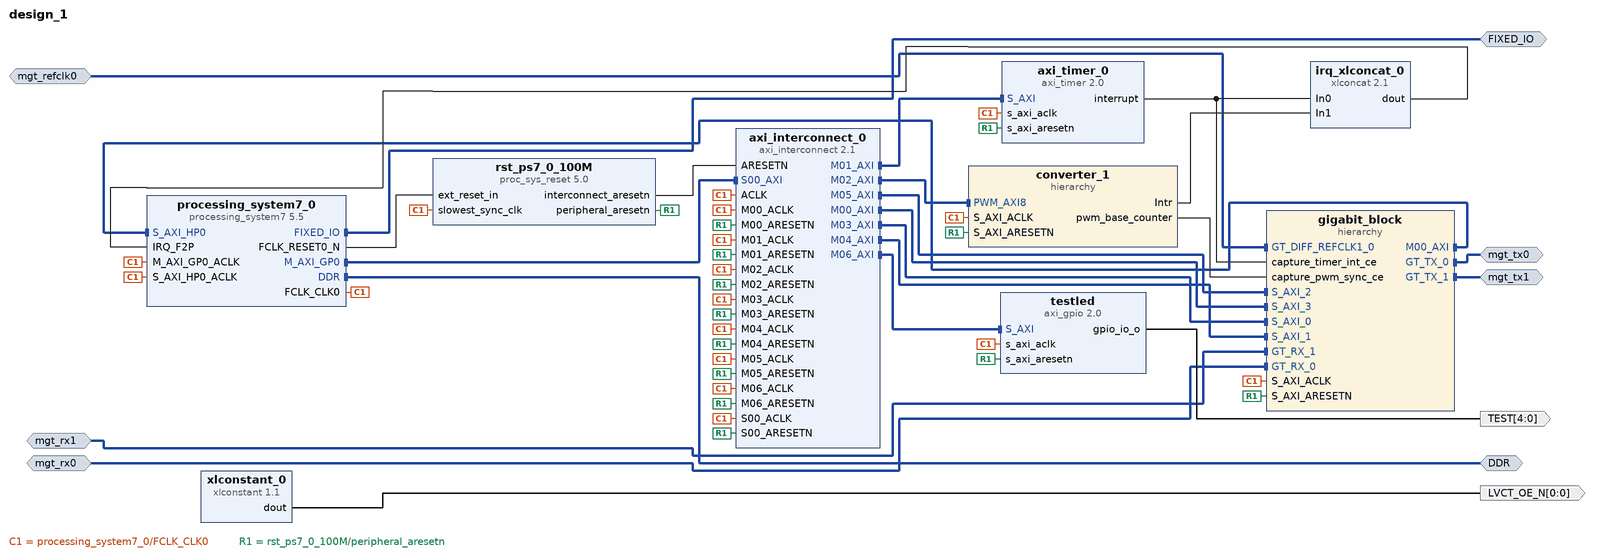
[diagram p0: block diagram of the top level]
# Vivado block design design_1, xc7z030sbg485-1, Vivado 2019.1
create_bd_design design_1

create_bd_intf_port -mode Master -vlnv xilinx.com:interface:ddrx_rtl:1.0 DDR
create_bd_intf_port -mode Master -vlnv xilinx.com:display_processing_system7:fixedio_rtl:1.0 FIXED_IO
create_bd_intf_port -mode Master -vlnv xilinx.com:display_aurora:GT_Serial_Transceiver_Pins_TX_rtl:1.0 mgt_tx0
create_bd_intf_port -mode Master -vlnv xilinx.com:display_aurora:GT_Serial_Transceiver_Pins_TX_rtl:1.0 mgt_tx1
create_bd_intf_port -mode Slave -vlnv xilinx.com:display_aurora:GT_Serial_Transceiver_Pins_RX_rtl:1.0 mgt_rx0
create_bd_intf_port -mode Slave -vlnv xilinx.com:display_aurora:GT_Serial_Transceiver_Pins_RX_rtl:1.0 mgt_rx1
create_bd_intf_port -mode Slave -vlnv xilinx.com:interface:diff_clock_rtl:1.0 mgt_refclk0
set_property -dict {CONFIG.FREQ_HZ 125000000} [get_bd_intf_ports mgt_refclk0]
create_bd_port -dir O -from 0 -to 0 LVCT_OE_N
create_bd_port -dir O -from 4 -to 0 -type data TEST

create_bd_cell -type hier converter_1
create_bd_cell -type ip -vlnv xilinx.com:ip:axi_interconnect:2.1 axi_interconnect_0
set_property -dict {CONFIG.NUM_MI 7 CONFIG.SYNCHRONIZATION_STAGES 2} [get_bd_cells axi_interconnect_0]
create_bd_cell -type ip -vlnv xilinx.com:ip:axi_timer:2.0 axi_timer_0
create_bd_cell -type ip -vlnv xilinx.com:ip:xlconcat:2.1 irq_xlconcat_0
set_property -dict {CONFIG.NUM_PORTS 2} [get_bd_cells irq_xlconcat_0]
create_bd_cell -type ip -vlnv xilinx.com:ip:processing_system7:5.5 processing_system7_0
set_property -dict [list \
  CONFIG.PCW_APU_PERIPHERAL_FREQMHZ 667 \
  CONFIG.PCW_CAN1_CAN1_IO {MIO 48 .. 49} \
  CONFIG.PCW_CAN1_PERIPHERAL_ENABLE 1 \
  CONFIG.PCW_ENET0_ENET0_IO {MIO 16 .. 27} \
  CONFIG.PCW_ENET0_GRP_MDIO_ENABLE 1 \
  CONFIG.PCW_ENET0_GRP_MDIO_IO {MIO 52 .. 53} \
  CONFIG.PCW_ENET0_PERIPHERAL_ENABLE 1 \
  CONFIG.PCW_ENET0_RESET_ENABLE 0 \
  CONFIG.PCW_ENET_RESET_ENABLE 1 \
  CONFIG.PCW_ENET_RESET_SELECT {Share reset pin} \
  CONFIG.PCW_EN_CLK1_PORT 1 \
  CONFIG.PCW_FCLK_CLK1_BUF TRUE \
  CONFIG.PCW_FPGA0_PERIPHERAL_FREQMHZ 100 \
  CONFIG.PCW_FPGA1_PERIPHERAL_FREQMHZ 200 \
  CONFIG.PCW_FPGA2_PERIPHERAL_FREQMHZ 33.333333 \
  CONFIG.PCW_FPGA_FCLK1_ENABLE 1 \
  CONFIG.PCW_GPIO_MIO_GPIO_ENABLE 1 \
  CONFIG.PCW_GPIO_MIO_GPIO_IO MIO \
  CONFIG.PCW_GPIO_PERIPHERAL_ENABLE 1 \
  CONFIG.PCW_I2C_RESET_ENABLE 0 \
  CONFIG.PCW_IRQ_F2P_INTR 1 \
  CONFIG.PCW_PERIPHERAL_BOARD_PRESET part0 \
  CONFIG.PCW_PRESET_BANK1_VOLTAGE {LVCMOS 1.8V} \
  CONFIG.PCW_QSPI_GRP_FBCLK_ENABLE 1 \
  CONFIG.PCW_QSPI_GRP_FBCLK_IO {MIO 8} \
  CONFIG.PCW_QSPI_GRP_SINGLE_SS_ENABLE 1 \
  CONFIG.PCW_QSPI_GRP_SINGLE_SS_IO {MIO 1 .. 6} \
  CONFIG.PCW_QSPI_PERIPHERAL_ENABLE 1 \
  CONFIG.PCW_QSPI_QSPI_IO {MIO 1 .. 6} \
  CONFIG.PCW_SD0_PERIPHERAL_ENABLE 0 \
  CONFIG.PCW_SD1_PERIPHERAL_ENABLE 1 \
  CONFIG.PCW_SD1_SD1_IO {MIO 10 .. 15} \
  CONFIG.PCW_SDIO_PERIPHERAL_FREQMHZ 25 \
  CONFIG.PCW_SINGLE_QSPI_DATA_MODE x4 \
  CONFIG.PCW_SPI0_PERIPHERAL_ENABLE 1 \
  CONFIG.PCW_SPI0_SPI0_IO {MIO 40 .. 45} \
  CONFIG.PCW_S_AXI_HP0_DATA_WIDTH 32 \
  CONFIG.PCW_UART0_PERIPHERAL_ENABLE 1 \
  CONFIG.PCW_UART0_UART0_IO {MIO 50 .. 51} \
  CONFIG.PCW_UART1_PERIPHERAL_ENABLE 0 \
  CONFIG.PCW_UART_PERIPHERAL_FREQMHZ 50 \
  CONFIG.PCW_UIPARAM_DDR_FREQ_MHZ 533.333333 \
  CONFIG.PCW_UIPARAM_DDR_MEMORY_TYPE {DDR 3 (Low Voltage)} \
  CONFIG.PCW_UIPARAM_DDR_PARTNO {MT41K256M16 RE-125} \
  CONFIG.PCW_USB0_PERIPHERAL_ENABLE 0 \
  CONFIG.PCW_USB_RESET_ENABLE 1 \
  CONFIG.PCW_USE_FABRIC_INTERRUPT 1 \
  CONFIG.PCW_USE_S_AXI_HP0 1 \
] [get_bd_cells processing_system7_0]
# 514 more settings of processing_system7_0 are not shown: defaults, MIO pin electricals, DDR timing, and values the tool derives
create_bd_cell -type ip -vlnv xilinx.com:ip:proc_sys_reset:5.0 rst_ps7_0_100M
create_bd_cell -type hier gigabit_block
create_bd_cell -type ip -vlnv xilinx.com:ip:xlconstant:1.1 xlconstant_0
set_property -dict {CONFIG.CONST_VAL 0} [get_bd_cells xlconstant_0]
create_bd_cell -type ip -vlnv xilinx.com:ip:axi_gpio:2.0 testled
set_property -dict {CONFIG.C_GPIO_WIDTH 5} [get_bd_cells testled]

# ---- hierarchy /converter_1 ----
current_bd_instance /converter_1
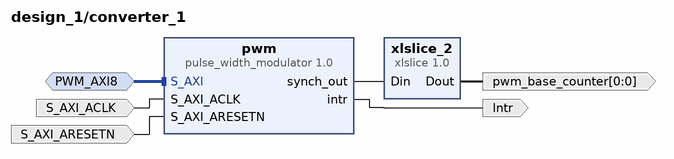
[diagram p1: block diagram inside /converter_1]
create_bd_intf_pin -mode Slave -vlnv xilinx.com:interface:aximm_rtl:1.0 PWM_AXI8
create_bd_pin -dir I -type clk S_AXI_ACLK
create_bd_pin -dir I -type rst S_AXI_ARESETN
create_bd_pin -dir O Intr
create_bd_pin -dir O -from 0 -to 0 pwm_base_counter

create_bd_cell -type ip -vlnv sintef.no:user:pulse_width_modulator:1.0 pwm
set_property -dict {CONFIG.HYSTERESIS_DEFAULT_VALUE 0 CONFIG.INTERRUPT_DIVISOR_WIDTH 8} [get_bd_cells pwm]
create_bd_cell -type ip -vlnv xilinx.com:ip:xlslice:1.0 xlslice_2
set_property -dict {CONFIG.DIN_FROM 2 CONFIG.DIN_TO 2 CONFIG.DIN_WIDTH 3 CONFIG.DOUT_WIDTH 1} [get_bd_cells xlslice_2]

# ---- hierarchy /gigabit_block ----
current_bd_instance /gigabit_block
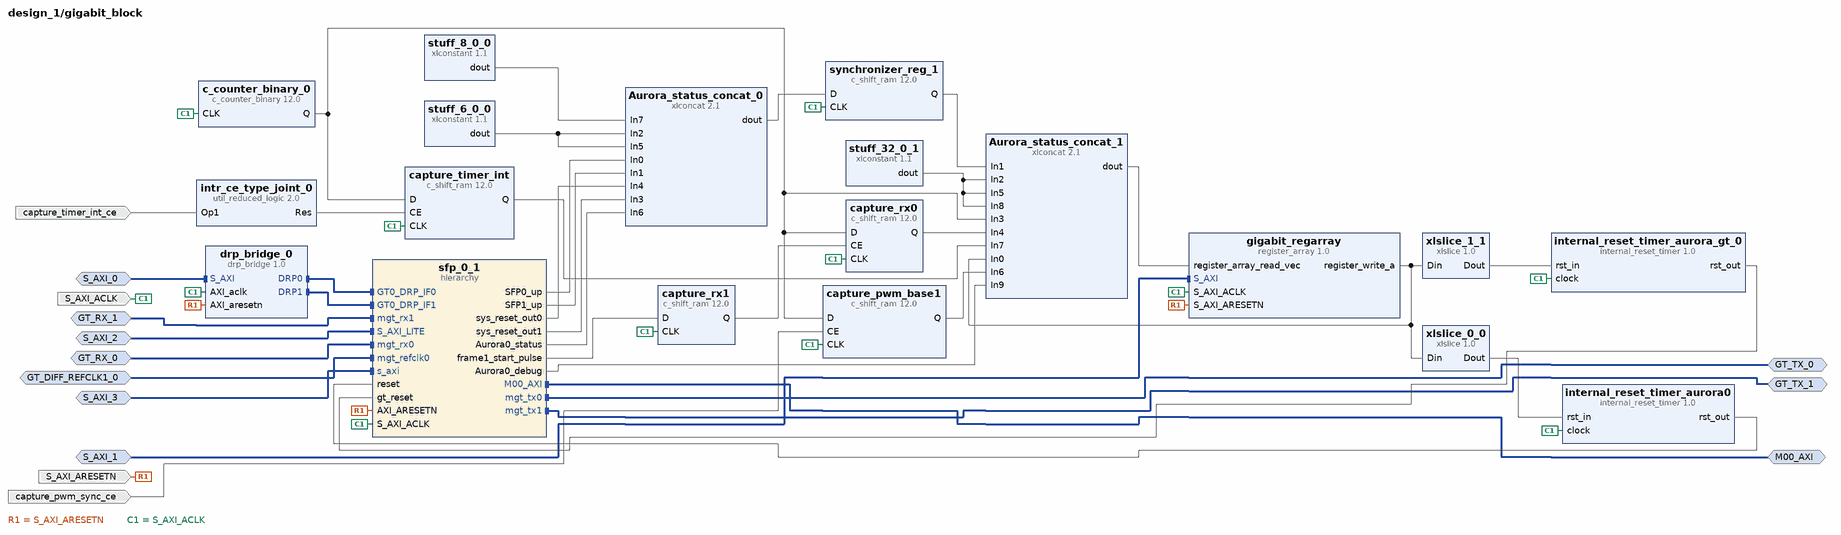
[diagram p2: block diagram inside /gigabit_block]
create_bd_intf_pin -mode Slave -vlnv xilinx.com:interface:diff_clock_rtl:1.0 GT_DIFF_REFCLK1_0
create_bd_intf_pin -mode Slave -vlnv xilinx.com:display_aurora:GT_Serial_Transceiver_Pins_RX_rtl:1.0 GT_RX_0
create_bd_intf_pin -mode Slave -vlnv xilinx.com:display_aurora:GT_Serial_Transceiver_Pins_RX_rtl:1.0 GT_RX_1
create_bd_intf_pin -mode Master -vlnv xilinx.com:display_aurora:GT_Serial_Transceiver_Pins_TX_rtl:1.0 GT_TX_0
create_bd_intf_pin -mode Master -vlnv xilinx.com:display_aurora:GT_Serial_Transceiver_Pins_TX_rtl:1.0 GT_TX_1
create_bd_intf_pin -mode Master -vlnv xilinx.com:interface:aximm_rtl:1.0 M00_AXI
create_bd_intf_pin -mode Slave -vlnv xilinx.com:interface:aximm_rtl:1.0 S_AXI_0
create_bd_intf_pin -mode Slave -vlnv xilinx.com:interface:aximm_rtl:1.0 S_AXI_1
create_bd_intf_pin -mode Slave -vlnv xilinx.com:interface:aximm_rtl:1.0 S_AXI_2
create_bd_intf_pin -mode Slave -vlnv xilinx.com:interface:aximm_rtl:1.0 S_AXI_3
create_bd_pin -dir I -type clk S_AXI_ACLK
create_bd_pin -dir I S_AXI_ARESETN
create_bd_pin -dir I capture_pwm_sync_ce
create_bd_pin -dir I capture_timer_int_ce

create_bd_cell -type ip -vlnv xilinx.com:ip:xlconcat:2.1 Aurora_status_concat_0
set_property -dict {CONFIG.NUM_PORTS 8} [get_bd_cells Aurora_status_concat_0]
create_bd_cell -type ip -vlnv xilinx.com:ip:xlconcat:2.1 Aurora_status_concat_1
set_property -dict {CONFIG.NUM_PORTS 10} [get_bd_cells Aurora_status_concat_1]
create_bd_cell -type ip -vlnv xilinx.com:ip:c_counter_binary:12.0 c_counter_binary_0
set_property -dict [list \
  CONFIG.CE false \
  CONFIG.Count_Mode UP \
  CONFIG.Latency 1 \
  CONFIG.Latency_Configuration Manual \
  CONFIG.Load false \
  CONFIG.Output_Width 32 \
  CONFIG.Restrict_Count false \
  CONFIG.SCLR false \
  CONFIG.SINIT false \
  CONFIG.SSET false \
  CONFIG.Sync_Threshold_Output false \
] [get_bd_cells c_counter_binary_0]
create_bd_cell -type ip -vlnv xilinx.com:ip:c_shift_ram:12.0 capture_pwm_base1
set_property -dict {CONFIG.CE true CONFIG.Depth 1} [get_bd_cells capture_pwm_base1]
create_bd_cell -type ip -vlnv xilinx.com:ip:c_shift_ram:12.0 capture_rx0
set_property -dict {CONFIG.CE true CONFIG.Depth 1} [get_bd_cells capture_rx0]
create_bd_cell -type ip -vlnv xilinx.com:ip:c_shift_ram:12.0 capture_timer_int
set_property -dict {CONFIG.CE true CONFIG.Depth 1} [get_bd_cells capture_timer_int]
create_bd_cell -type ip -vlnv xilinx.com:user:drp_bridge:1.0 drp_bridge_0
set_property -dict {CONFIG.DRP_COUNT 2 CONFIG.DRP_DATA_WIDTH 16} [get_bd_cells drp_bridge_0]
create_bd_cell -type ip -vlnv sintef.no:user:register_array:1.0 gigabit_regarray
set_property -dict {CONFIG.NUMBER_OF_REGISTERS 10} [get_bd_cells gigabit_regarray]
create_bd_cell -type ip -vlnv sintef.no:user:internal_reset_timer:1.0 internal_reset_timer_aurora0
set_property -dict [list \
  CONFIG.RESET_IN_ACTIVE {"1"} \
  CONFIG.RESET_OUT_ACTIVE {"1"} \
  CONFIG.RESET_TIME 1000 \
] [get_bd_cells internal_reset_timer_aurora0]
create_bd_cell -type ip -vlnv sintef.no:user:internal_reset_timer:1.0 internal_reset_timer_aurora_gt_0
set_property -dict {CONFIG.RESET_IN_ACTIVE {"1"} CONFIG.RESET_OUT_ACTIVE {"1"}} [get_bd_cells internal_reset_timer_aurora_gt_0]
create_bd_cell -type ip -vlnv xilinx.com:ip:util_reduced_logic:2.0 intr_ce_type_joint_0
set_property -dict {CONFIG.C_SIZE 1} [get_bd_cells intr_ce_type_joint_0]
create_bd_cell -type hier sfp_0_1
create_bd_cell -type ip -vlnv xilinx.com:ip:xlconstant:1.1 stuff_8_0_0
set_property -dict {CONFIG.CONST_VAL 0 CONFIG.CONST_WIDTH 8} [get_bd_cells stuff_8_0_0]
create_bd_cell -type ip -vlnv xilinx.com:ip:xlconstant:1.1 stuff_32_0_1
set_property -dict {CONFIG.CONST_VAL 0 CONFIG.CONST_WIDTH 32} [get_bd_cells stuff_32_0_1]
create_bd_cell -type ip -vlnv xilinx.com:ip:xlconstant:1.1 stuff_6_0_0
set_property -dict {CONFIG.CONST_VAL 0 CONFIG.CONST_WIDTH 6} [get_bd_cells stuff_6_0_0]
create_bd_cell -type ip -vlnv xilinx.com:ip:c_shift_ram:12.0 synchronizer_reg_1
set_property -dict [list \
  CONFIG.AsyncInitVal 00000000000000000000000000000000 \
  CONFIG.CE false \
  CONFIG.DefaultData 00000000000000000000000000000000 \
  CONFIG.Depth 1 \
  CONFIG.ShiftRegType Fixed_Length \
  CONFIG.Width 32 \
] [get_bd_cells synchronizer_reg_1]
create_bd_cell -type ip -vlnv xilinx.com:ip:xlslice:1.0 xlslice_0_0
create_bd_cell -type ip -vlnv xilinx.com:ip:xlslice:1.0 xlslice_1_1
set_property -dict {CONFIG.DIN_FROM 1 CONFIG.DIN_TO 1 CONFIG.DOUT_WIDTH 1} [get_bd_cells xlslice_1_1]
create_bd_cell -type ip -vlnv xilinx.com:ip:c_shift_ram:12.0 capture_rx1
set_property -dict {CONFIG.CE false CONFIG.Depth 3} [get_bd_cells capture_rx1]

# ---- hierarchy /gigabit_block/sfp_0_1 ----
current_bd_instance /gigabit_block/sfp_0_1
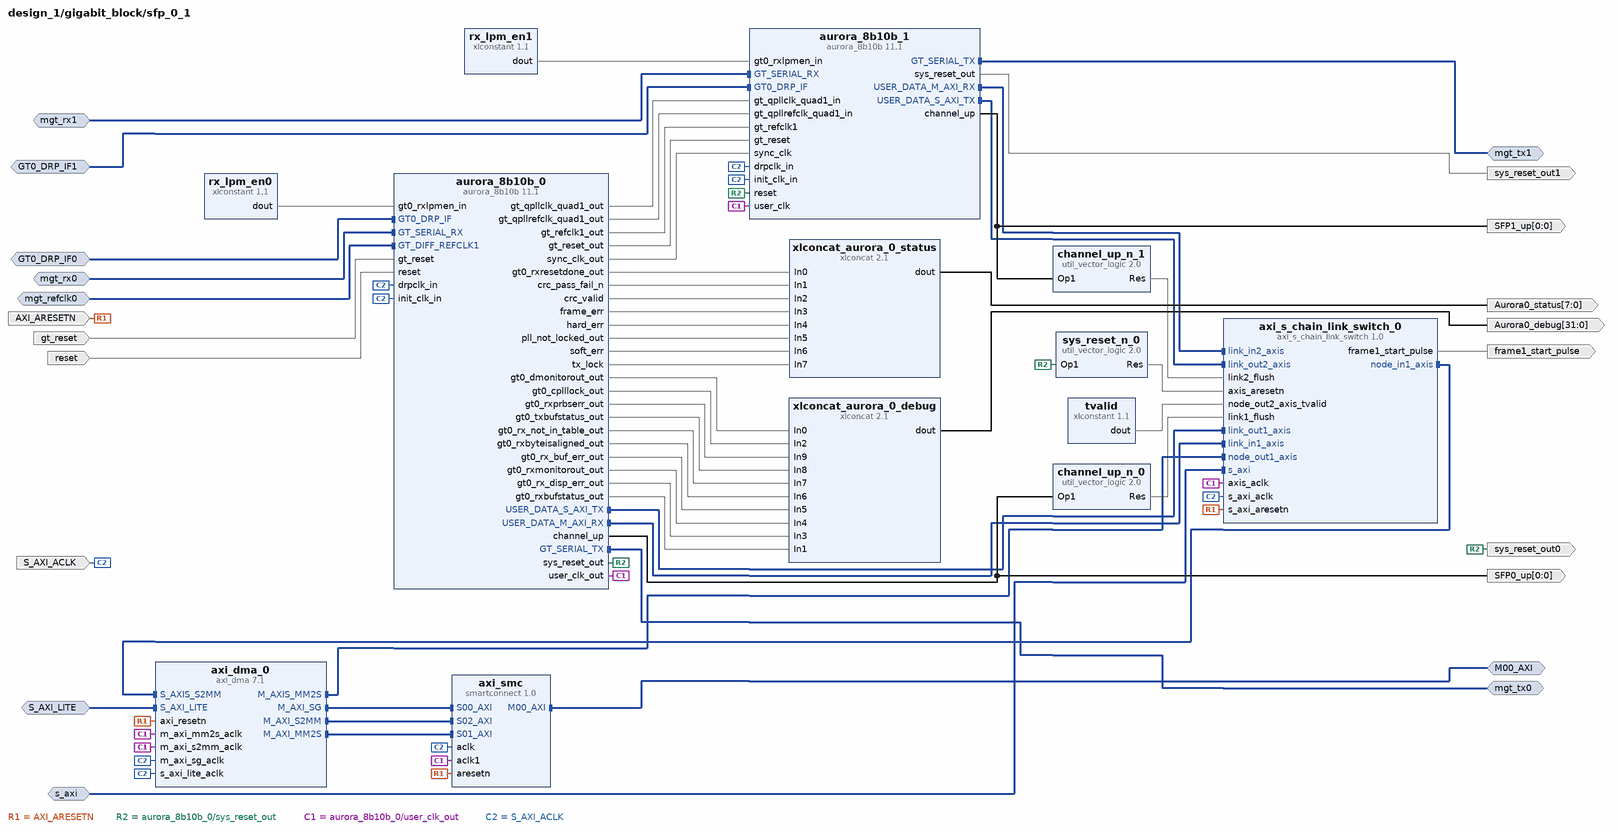
[diagram p3: block diagram inside /gigabit_block/sfp_0_1]
create_bd_intf_pin -mode Slave -vlnv xilinx.com:interface:drp_rtl:1.0 GT0_DRP_IF0
create_bd_intf_pin -mode Slave -vlnv xilinx.com:interface:drp_rtl:1.0 GT0_DRP_IF1
create_bd_intf_pin -mode Master -vlnv xilinx.com:interface:aximm_rtl:1.0 M00_AXI
create_bd_intf_pin -mode Slave -vlnv xilinx.com:interface:aximm_rtl:1.0 S_AXI_LITE
create_bd_intf_pin -mode Slave -vlnv xilinx.com:interface:diff_clock_rtl:1.0 mgt_refclk0
create_bd_intf_pin -mode Slave -vlnv xilinx.com:display_aurora:GT_Serial_Transceiver_Pins_RX_rtl:1.0 mgt_rx0
create_bd_intf_pin -mode Slave -vlnv xilinx.com:display_aurora:GT_Serial_Transceiver_Pins_RX_rtl:1.0 mgt_rx1
create_bd_intf_pin -mode Master -vlnv xilinx.com:display_aurora:GT_Serial_Transceiver_Pins_TX_rtl:1.0 mgt_tx0
create_bd_intf_pin -mode Master -vlnv xilinx.com:display_aurora:GT_Serial_Transceiver_Pins_TX_rtl:1.0 mgt_tx1
create_bd_intf_pin -mode Slave -vlnv xilinx.com:interface:aximm_rtl:1.0 s_axi
create_bd_pin -dir I AXI_ARESETN
create_bd_pin -dir O -from 0 -to 0 SFP0_up
create_bd_pin -dir O -from 0 -to 0 SFP1_up
create_bd_pin -dir I -type clk S_AXI_ACLK
create_bd_pin -dir O frame1_start_pulse
create_bd_pin -dir I gt_reset
create_bd_pin -dir I reset
create_bd_pin -dir O sys_reset_out0
create_bd_pin -dir O sys_reset_out1
create_bd_pin -dir O -from 7 -to 0 Aurora0_status
create_bd_pin -dir O -from 31 -to 0 Aurora0_debug

create_bd_cell -type ip -vlnv xilinx.com:ip:aurora_8b10b:11.1 aurora_8b10b_0
set_property -dict [list \
  CONFIG.C_DRP_IF true \
  CONFIG.C_LANE_WIDTH 4 \
  CONFIG.C_LINE_RATE 5 \
  CONFIG.C_USE_BYTESWAP true \
  CONFIG.C_USE_CRC true \
  CONFIG.SINGLEEND_INITCLK true \
  CONFIG.SupportLevel 1 \
  CONFIG.TransceiverControl true \
] [get_bd_cells aurora_8b10b_0]
create_bd_cell -type ip -vlnv xilinx.com:ip:aurora_8b10b:11.1 aurora_8b10b_1
set_property -dict [list \
  CONFIG.C_DRP_IF true \
  CONFIG.C_LANE_WIDTH 4 \
  CONFIG.C_LINE_RATE 5 \
  CONFIG.C_USE_BYTESWAP true \
  CONFIG.C_USE_CRC true \
  CONFIG.TransceiverControl true \
] [get_bd_cells aurora_8b10b_1]
create_bd_cell -type ip -vlnv xilinx.com:ip:axi_dma:7.1 axi_dma_0
set_property -dict [list \
  CONFIG.c_enable_multi_channel 0 \
  CONFIG.c_include_mm2s 1 \
  CONFIG.c_include_mm2s_dre 1 \
  CONFIG.c_include_s2mm 1 \
  CONFIG.c_include_s2mm_dre 1 \
  CONFIG.c_include_sg 1 \
  CONFIG.c_micro_dma 0 \
  CONFIG.c_mm2s_burst_size 256 \
  CONFIG.c_s2mm_burst_size 256 \
  CONFIG.c_sg_include_stscntrl_strm 0 \
  CONFIG.c_sg_length_width 26 \
] [get_bd_cells axi_dma_0]
create_bd_cell -type ip -vlnv sintef.no:sintef_ip:axi_s_chain_link_switch:1.0 axi_s_chain_link_switch_0
set_property -dict [list \
  CONFIG.CONFIG_REGISTER_DEFAULTVALUE 0x04000400 \
  CONFIG.LINK_FIFO_SIZE 2048 \
] [get_bd_cells axi_s_chain_link_switch_0]
create_bd_cell -type ip -vlnv xilinx.com:ip:smartconnect:1.0 axi_smc
set_property -dict {CONFIG.NUM_CLKS 2 CONFIG.NUM_SI 3} [get_bd_cells axi_smc]
create_bd_cell -type ip -vlnv xilinx.com:ip:util_vector_logic:2.0 channel_up_n_0
set_property -dict {CONFIG.C_OPERATION not CONFIG.C_SIZE 1} [get_bd_cells channel_up_n_0]
create_bd_cell -type ip -vlnv xilinx.com:ip:util_vector_logic:2.0 channel_up_n_1
set_property -dict {CONFIG.C_OPERATION not CONFIG.C_SIZE 1} [get_bd_cells channel_up_n_1]
create_bd_cell -type ip -vlnv xilinx.com:ip:xlconstant:1.1 rx_lpm_en0
set_property -dict {CONFIG.CONST_VAL 1} [get_bd_cells rx_lpm_en0]
create_bd_cell -type ip -vlnv xilinx.com:ip:xlconstant:1.1 rx_lpm_en1
set_property -dict {CONFIG.CONST_VAL 1} [get_bd_cells rx_lpm_en1]
create_bd_cell -type ip -vlnv xilinx.com:ip:util_vector_logic:2.0 sys_reset_n_0
set_property -dict {CONFIG.C_OPERATION not CONFIG.C_SIZE 1} [get_bd_cells sys_reset_n_0]
create_bd_cell -type ip -vlnv xilinx.com:ip:xlconstant:1.1 tvalid
set_property -dict {CONFIG.CONST_VAL 0} [get_bd_cells tvalid]
create_bd_cell -type ip -vlnv xilinx.com:ip:xlconcat:2.1 xlconcat_aurora_0_status
set_property -dict {CONFIG.NUM_PORTS 8} [get_bd_cells xlconcat_aurora_0_status]
create_bd_cell -type ip -vlnv xilinx.com:ip:xlconcat:2.1 xlconcat_aurora_0_debug
set_property -dict {CONFIG.NUM_PORTS 10} [get_bd_cells xlconcat_aurora_0_debug]

# ---- connections ----

current_bd_instance /converter_1
connect_bd_intf_net -intf_net axi_interconnect_0_M13_AXI [get_bd_intf_pins PWM_AXI8] [get_bd_intf_pins pwm/S_AXI]
connect_bd_net -net processing_system7_0_FCLK_CLK0 [get_bd_pins S_AXI_ACLK] [get_bd_pins pwm/S_AXI_ACLK]
connect_bd_net -net rst_ps7_0_100M_peripheral_aresetn [get_bd_pins S_AXI_ARESETN] [get_bd_pins pwm/S_AXI_ARESETN]
connect_bd_net -net pwm_2_intr [get_bd_pins pwm/intr] [get_bd_pins Intr]
connect_bd_net [get_bd_pins pwm/synch_out] [get_bd_pins xlslice_2/Din]
connect_bd_net [get_bd_pins xlslice_2/Dout] [get_bd_pins pwm_base_counter]

current_bd_instance /gigabit_block
connect_bd_intf_net -intf_net S_AXI_1_1 [get_bd_intf_pins S_AXI_1] [get_bd_intf_pins gigabit_regarray/S_AXI]
connect_bd_intf_net [get_bd_intf_pins S_AXI_0] [get_bd_intf_pins drp_bridge_0/S_AXI]
connect_bd_intf_net [get_bd_intf_pins M00_AXI] [get_bd_intf_pins sfp_0_1/M00_AXI]
connect_bd_intf_net [get_bd_intf_pins drp_bridge_0/DRP0] [get_bd_intf_pins sfp_0_1/GT0_DRP_IF0]
connect_bd_intf_net -intf_net GT_RX_1_1 [get_bd_intf_pins GT_RX_1] [get_bd_intf_pins sfp_0_1/mgt_rx1]
connect_bd_intf_net -intf_net axi_interconnect_0_M37_AXI [get_bd_intf_pins S_AXI_2] [get_bd_intf_pins sfp_0_1/S_AXI_LITE]
connect_bd_intf_net [get_bd_intf_pins drp_bridge_0/DRP1] [get_bd_intf_pins sfp_0_1/GT0_DRP_IF1]
connect_bd_intf_net [get_bd_intf_pins GT_TX_0] [get_bd_intf_pins sfp_0_1/mgt_tx0]
connect_bd_intf_net -intf_net GT_RX_0_1 [get_bd_intf_pins GT_RX_0] [get_bd_intf_pins sfp_0_1/mgt_rx0]
connect_bd_intf_net -intf_net GT_DIFF_REFCLK1_0_1 [get_bd_intf_pins GT_DIFF_REFCLK1_0] [get_bd_intf_pins sfp_0_1/mgt_refclk0]
connect_bd_intf_net [get_bd_intf_pins GT_TX_1] [get_bd_intf_pins sfp_0_1/mgt_tx1]
connect_bd_intf_net -intf_net axi_interconnect_0_M38_AXI [get_bd_intf_pins S_AXI_3] [get_bd_intf_pins sfp_0_1/s_axi]
connect_bd_net [get_bd_pins Aurora_status_concat_0/dout] [get_bd_pins synchronizer_reg_1/D]
connect_bd_net [get_bd_pins Aurora_status_concat_1/dout] [get_bd_pins gigabit_regarray/register_array_read_vec]
connect_bd_net [get_bd_pins S_AXI_ARESETN] \
  [get_bd_pins drp_bridge_0/AXI_aresetn] [get_bd_pins gigabit_regarray/S_AXI_ARESETN] [get_bd_pins sfp_0_1/AXI_ARESETN]
connect_bd_net [get_bd_pins c_counter_binary_0/Q] \
  [get_bd_pins Aurora_status_concat_1/In3] [get_bd_pins capture_pwm_base1/D] [get_bd_pins capture_rx0/D] \
  [get_bd_pins capture_timer_int/D]
connect_bd_net [get_bd_pins capture_pwm_base1/Q] [get_bd_pins Aurora_status_concat_1/In6]
connect_bd_net [get_bd_pins capture_pwm_sync_ce] [get_bd_pins capture_pwm_base1/CE]
connect_bd_net [get_bd_pins capture_rx0/Q] [get_bd_pins Aurora_status_concat_1/In4]
connect_bd_net [get_bd_pins capture_timer_int/Q] [get_bd_pins Aurora_status_concat_1/In7]
connect_bd_net [get_bd_pins capture_timer_int_ce] [get_bd_pins intr_ce_type_joint_0/Op1]
connect_bd_net -net internal_reset_timer_0_rst_out [get_bd_pins internal_reset_timer_aurora0/rst_out] [get_bd_pins sfp_0_1/reset]
connect_bd_net -net internal_reset_timer_1_rst_out [get_bd_pins internal_reset_timer_aurora_gt_0/rst_out] [get_bd_pins sfp_0_1/gt_reset]
connect_bd_net [get_bd_pins intr_ce_type_joint_0/Res] [get_bd_pins capture_timer_int/CE]
connect_bd_net -net processing_system7_0_FCLK_CLK0 [get_bd_pins S_AXI_ACLK] \
  [get_bd_pins c_counter_binary_0/CLK] [get_bd_pins capture_pwm_base1/CLK] [get_bd_pins capture_rx0/CLK] \
  [get_bd_pins capture_timer_int/CLK] [get_bd_pins drp_bridge_0/AXI_aclk] [get_bd_pins gigabit_regarray/S_AXI_ACLK] \
  [get_bd_pins internal_reset_timer_aurora0/clock] [get_bd_pins internal_reset_timer_aurora_gt_0/clock] \
  [get_bd_pins sfp_0_1/S_AXI_ACLK] [get_bd_pins synchronizer_reg_1/CLK] [get_bd_pins capture_rx1/CLK]
connect_bd_net -net register_array_1_register_write_a [get_bd_pins gigabit_regarray/register_write_a] \
  [get_bd_pins Aurora_status_concat_1/In0] [get_bd_pins xlslice_0_0/Din] [get_bd_pins xlslice_1_1/Din]
connect_bd_net -net sfp_0_1_Op1 [get_bd_pins sfp_0_1/SFP0_up] [get_bd_pins Aurora_status_concat_0/In0]
connect_bd_net -net sfp_0_1_Op2 [get_bd_pins sfp_0_1/SFP1_up] [get_bd_pins Aurora_status_concat_0/In1]
connect_bd_net [get_bd_pins sfp_0_1/sys_reset_out0] [get_bd_pins Aurora_status_concat_0/In4]
connect_bd_net [get_bd_pins sfp_0_1/sys_reset_out1] [get_bd_pins Aurora_status_concat_0/In3]
connect_bd_net [get_bd_pins stuff_32_0_1/dout] \
  [get_bd_pins Aurora_status_concat_1/In2] [get_bd_pins Aurora_status_concat_1/In5] [get_bd_pins Aurora_status_concat_1/In8]
connect_bd_net -net stuff_6_0_1_dout [get_bd_pins stuff_8_0_0/dout] [get_bd_pins Aurora_status_concat_0/In7]
connect_bd_net [get_bd_pins synchronizer_reg_1/Q] [get_bd_pins Aurora_status_concat_1/In1]
connect_bd_net -net xlslice_1_Dout [get_bd_pins xlslice_0_0/Dout] [get_bd_pins internal_reset_timer_aurora0/rst_in]
connect_bd_net -net xlslice_2_Dout [get_bd_pins xlslice_1_1/Dout] [get_bd_pins internal_reset_timer_aurora_gt_0/rst_in]
connect_bd_net [get_bd_pins capture_rx1/Q] [get_bd_pins capture_rx0/CE]
connect_bd_net -net sfp_0_1_frame1_start_puls [get_bd_pins sfp_0_1/frame1_start_pulse] [get_bd_pins capture_rx1/D]
connect_bd_net [get_bd_pins stuff_6_0_0/dout] [get_bd_pins Aurora_status_concat_0/In2] [get_bd_pins Aurora_status_concat_0/In5]
connect_bd_net [get_bd_pins sfp_0_1/Aurora0_status] [get_bd_pins Aurora_status_concat_0/In6]
connect_bd_net [get_bd_pins sfp_0_1/Aurora0_debug] [get_bd_pins Aurora_status_concat_1/In9]

current_bd_instance /gigabit_block/sfp_0_1
connect_bd_intf_net [get_bd_intf_pins GT0_DRP_IF0] [get_bd_intf_pins aurora_8b10b_0/GT0_DRP_IF]
connect_bd_intf_net -intf_net axi_s_chain_link_swi_0_link_out1_axis [get_bd_intf_pins aurora_8b10b_0/USER_DATA_S_AXI_TX] [get_bd_intf_pins axi_s_chain_link_switch_0/link_out1_axis]
connect_bd_intf_net -intf_net mgt_rx0_1 [get_bd_intf_pins mgt_rx0] [get_bd_intf_pins aurora_8b10b_0/GT_SERIAL_RX]
connect_bd_intf_net [get_bd_intf_pins axi_dma_0/M_AXI_SG] [get_bd_intf_pins axi_smc/S00_AXI]
connect_bd_intf_net [get_bd_intf_pins aurora_8b10b_0/USER_DATA_M_AXI_RX] [get_bd_intf_pins axi_s_chain_link_switch_0/link_in1_axis]
connect_bd_intf_net [get_bd_intf_pins axi_dma_0/M_AXIS_MM2S] [get_bd_intf_pins axi_s_chain_link_switch_0/node_out1_axis]
connect_bd_intf_net -intf_net axi_interconnect_0_M37_AXI [get_bd_intf_pins S_AXI_LITE] [get_bd_intf_pins axi_dma_0/S_AXI_LITE]
connect_bd_intf_net [get_bd_intf_pins aurora_8b10b_1/USER_DATA_M_AXI_RX] [get_bd_intf_pins axi_s_chain_link_switch_0/link_in2_axis]
connect_bd_intf_net [get_bd_intf_pins mgt_tx1] [get_bd_intf_pins aurora_8b10b_1/GT_SERIAL_TX]
connect_bd_intf_net -intf_net axi_s_chain_link_swi_0_link_out2_axis [get_bd_intf_pins aurora_8b10b_1/USER_DATA_S_AXI_TX] [get_bd_intf_pins axi_s_chain_link_switch_0/link_out2_axis]
connect_bd_intf_net [get_bd_intf_pins axi_dma_0/M_AXI_S2MM] [get_bd_intf_pins axi_smc/S02_AXI]
connect_bd_intf_net -intf_net mgt_rx1_1 [get_bd_intf_pins mgt_rx1] [get_bd_intf_pins aurora_8b10b_1/GT_SERIAL_RX]
connect_bd_intf_net -intf_net axi_s_chain_link_swi_0_node_in1_axis [get_bd_intf_pins axi_dma_0/S_AXIS_S2MM] [get_bd_intf_pins axi_s_chain_link_switch_0/node_in1_axis]
connect_bd_intf_net -intf_net mgt_refclk0_1 [get_bd_intf_pins mgt_refclk0] [get_bd_intf_pins aurora_8b10b_0/GT_DIFF_REFCLK1]
connect_bd_intf_net -intf_net axi_interconnect_0_M38_AXI [get_bd_intf_pins s_axi] [get_bd_intf_pins axi_s_chain_link_switch_0/s_axi]
connect_bd_intf_net -intf_net GT0_DRP_IF1_1 [get_bd_intf_pins GT0_DRP_IF1] [get_bd_intf_pins aurora_8b10b_1/GT0_DRP_IF]
connect_bd_intf_net [get_bd_intf_pins mgt_tx0] [get_bd_intf_pins aurora_8b10b_0/GT_SERIAL_TX]
connect_bd_intf_net [get_bd_intf_pins axi_dma_0/M_AXI_MM2S] [get_bd_intf_pins axi_smc/S01_AXI]
connect_bd_intf_net [get_bd_intf_pins M00_AXI] [get_bd_intf_pins axi_smc/M00_AXI]
connect_bd_net [get_bd_pins AXI_ARESETN] \
  [get_bd_pins axi_dma_0/axi_resetn] [get_bd_pins axi_s_chain_link_switch_0/s_axi_aresetn] [get_bd_pins axi_smc/aresetn]
connect_bd_net [get_bd_pins aurora_8b10b_0/channel_up] [get_bd_pins SFP0_up] [get_bd_pins channel_up_n_0/Op1]
connect_bd_net [get_bd_pins aurora_8b10b_0/gt_qpllclk_quad1_out] [get_bd_pins aurora_8b10b_1/gt_qpllclk_quad1_in]
connect_bd_net [get_bd_pins aurora_8b10b_0/gt_qpllrefclk_quad1_out] [get_bd_pins aurora_8b10b_1/gt_qpllrefclk_quad1_in]
connect_bd_net [get_bd_pins aurora_8b10b_0/gt_refclk1_out] [get_bd_pins aurora_8b10b_1/gt_refclk1]
connect_bd_net [get_bd_pins aurora_8b10b_0/gt_reset_out] [get_bd_pins aurora_8b10b_1/gt_reset]
connect_bd_net [get_bd_pins aurora_8b10b_0/sync_clk_out] [get_bd_pins aurora_8b10b_1/sync_clk]
connect_bd_net [get_bd_pins aurora_8b10b_0/sys_reset_out] \
  [get_bd_pins sys_reset_out0] [get_bd_pins aurora_8b10b_1/reset] [get_bd_pins sys_reset_n_0/Op1]
connect_bd_net [get_bd_pins aurora_8b10b_0/user_clk_out] \
  [get_bd_pins aurora_8b10b_1/user_clk] [get_bd_pins axi_dma_0/m_axi_mm2s_aclk] [get_bd_pins axi_dma_0/m_axi_s2mm_aclk] \
  [get_bd_pins axi_s_chain_link_switch_0/axis_aclk] [get_bd_pins axi_smc/aclk1]
connect_bd_net [get_bd_pins aurora_8b10b_1/channel_up] [get_bd_pins SFP1_up] [get_bd_pins channel_up_n_1/Op1]
connect_bd_net [get_bd_pins aurora_8b10b_1/sys_reset_out] [get_bd_pins sys_reset_out1]
connect_bd_net -net axi_s_chain_link_swi_0_frame1_start_pulse [get_bd_pins axi_s_chain_link_switch_0/frame1_start_pulse] \
  [get_bd_pins frame1_start_pulse]
connect_bd_net [get_bd_pins channel_up_n_0/Res] [get_bd_pins axi_s_chain_link_switch_0/link1_flush]
connect_bd_net [get_bd_pins channel_up_n_1/Res] [get_bd_pins axi_s_chain_link_switch_0/link2_flush]
connect_bd_net [get_bd_pins gt_reset] [get_bd_pins aurora_8b10b_0/gt_reset]
connect_bd_net -net processing_system7_0_FCLK_CLK0 [get_bd_pins S_AXI_ACLK] \
  [get_bd_pins aurora_8b10b_0/drpclk_in] [get_bd_pins aurora_8b10b_0/init_clk_in] [get_bd_pins aurora_8b10b_1/drpclk_in] \
  [get_bd_pins aurora_8b10b_1/init_clk_in] [get_bd_pins axi_dma_0/m_axi_sg_aclk] [get_bd_pins axi_dma_0/s_axi_lite_aclk] \
  [get_bd_pins axi_s_chain_link_switch_0/s_axi_aclk] [get_bd_pins axi_smc/aclk]
connect_bd_net [get_bd_pins reset] [get_bd_pins aurora_8b10b_0/reset]
connect_bd_net [get_bd_pins rx_lpm_en1/dout] [get_bd_pins aurora_8b10b_1/gt0_rxlpmen_in]
connect_bd_net [get_bd_pins sys_reset_n_0/Res] [get_bd_pins axi_s_chain_link_switch_0/axis_aresetn]
connect_bd_net [get_bd_pins tvalid/dout] [get_bd_pins axi_s_chain_link_switch_0/node_out2_axis_tvalid]
connect_bd_net -net xlconstant_6_dout [get_bd_pins rx_lpm_en0/dout] [get_bd_pins aurora_8b10b_0/gt0_rxlpmen_in]
connect_bd_net [get_bd_pins aurora_8b10b_0/gt0_rxresetdone_out] [get_bd_pins xlconcat_aurora_0_status/In0]
connect_bd_net [get_bd_pins aurora_8b10b_0/crc_pass_fail_n] [get_bd_pins xlconcat_aurora_0_status/In1]
connect_bd_net [get_bd_pins aurora_8b10b_0/crc_valid] [get_bd_pins xlconcat_aurora_0_status/In2]
connect_bd_net [get_bd_pins aurora_8b10b_0/frame_err] [get_bd_pins xlconcat_aurora_0_status/In3]
connect_bd_net [get_bd_pins aurora_8b10b_0/hard_err] [get_bd_pins xlconcat_aurora_0_status/In4]
connect_bd_net [get_bd_pins aurora_8b10b_0/pll_not_locked_out] [get_bd_pins xlconcat_aurora_0_status/In5]
connect_bd_net [get_bd_pins aurora_8b10b_0/soft_err] [get_bd_pins xlconcat_aurora_0_status/In6]
connect_bd_net [get_bd_pins aurora_8b10b_0/tx_lock] [get_bd_pins xlconcat_aurora_0_status/In7]
connect_bd_net [get_bd_pins xlconcat_aurora_0_status/dout] [get_bd_pins Aurora0_status]
connect_bd_net [get_bd_pins xlconcat_aurora_0_debug/dout] [get_bd_pins Aurora0_debug]
connect_bd_net [get_bd_pins aurora_8b10b_0/gt0_dmonitorout_out] [get_bd_pins xlconcat_aurora_0_debug/In0]
connect_bd_net [get_bd_pins aurora_8b10b_0/gt0_cplllock_out] [get_bd_pins xlconcat_aurora_0_debug/In2]
connect_bd_net [get_bd_pins aurora_8b10b_0/gt0_rxprbserr_out] [get_bd_pins xlconcat_aurora_0_debug/In9]
connect_bd_net [get_bd_pins aurora_8b10b_0/gt0_txbufstatus_out] [get_bd_pins xlconcat_aurora_0_debug/In8]
connect_bd_net [get_bd_pins aurora_8b10b_0/gt0_rx_not_in_table_out] [get_bd_pins xlconcat_aurora_0_debug/In7]
connect_bd_net [get_bd_pins aurora_8b10b_0/gt0_rxbyteisaligned_out] [get_bd_pins xlconcat_aurora_0_debug/In6]
connect_bd_net [get_bd_pins aurora_8b10b_0/gt0_rx_buf_err_out] [get_bd_pins xlconcat_aurora_0_debug/In5]
connect_bd_net [get_bd_pins aurora_8b10b_0/gt0_rxmonitorout_out] [get_bd_pins xlconcat_aurora_0_debug/In4]
connect_bd_net [get_bd_pins aurora_8b10b_0/gt0_rx_disp_err_out] [get_bd_pins xlconcat_aurora_0_debug/In3]
connect_bd_net [get_bd_pins aurora_8b10b_0/gt0_rxbufstatus_out] [get_bd_pins xlconcat_aurora_0_debug/In1]

current_bd_instance /
connect_bd_intf_net -intf_net GT_DIFF_REFCLK1_0_1 [get_bd_intf_ports mgt_refclk0] [get_bd_intf_pins gigabit_block/GT_DIFF_REFCLK1_0]
connect_bd_intf_net [get_bd_intf_pins axi_interconnect_0/M02_AXI] [get_bd_intf_pins converter_1/PWM_AXI8]
connect_bd_intf_net [get_bd_intf_ports mgt_tx0] [get_bd_intf_pins gigabit_block/GT_TX_0]
connect_bd_intf_net [get_bd_intf_ports FIXED_IO] [get_bd_intf_pins processing_system7_0/FIXED_IO]
connect_bd_intf_net -intf_net GT_RX_1_1 [get_bd_intf_ports mgt_rx1] [get_bd_intf_pins gigabit_block/GT_RX_1]
connect_bd_intf_net [get_bd_intf_pins axi_interconnect_0/M05_AXI] [get_bd_intf_pins gigabit_block/S_AXI_2]
connect_bd_intf_net [get_bd_intf_pins axi_interconnect_0/M00_AXI] [get_bd_intf_pins gigabit_block/S_AXI_3]
connect_bd_intf_net [get_bd_intf_pins axi_interconnect_0/M01_AXI] [get_bd_intf_pins axi_timer_0/S_AXI]
connect_bd_intf_net [get_bd_intf_pins axi_interconnect_0/M06_AXI] [get_bd_intf_pins testled/S_AXI]
connect_bd_intf_net -intf_net GT_RX_0_1 [get_bd_intf_ports mgt_rx0] [get_bd_intf_pins gigabit_block/GT_RX_0]
connect_bd_intf_net [get_bd_intf_pins axi_interconnect_0/M03_AXI] [get_bd_intf_pins gigabit_block/S_AXI_0]
connect_bd_intf_net [get_bd_intf_ports mgt_tx1] [get_bd_intf_pins gigabit_block/GT_TX_1]
connect_bd_intf_net [get_bd_intf_pins axi_interconnect_0/S00_AXI] [get_bd_intf_pins processing_system7_0/M_AXI_GP0]
connect_bd_intf_net [get_bd_intf_ports DDR] [get_bd_intf_pins processing_system7_0/DDR]
connect_bd_intf_net [get_bd_intf_pins processing_system7_0/S_AXI_HP0] [get_bd_intf_pins gigabit_block/M00_AXI]
connect_bd_intf_net [get_bd_intf_pins axi_interconnect_0/M04_AXI] [get_bd_intf_pins gigabit_block/S_AXI_1]
connect_bd_net [get_bd_pins axi_timer_0/interrupt] [get_bd_pins irq_xlconcat_0/In0] [get_bd_pins gigabit_block/capture_timer_int_ce]
connect_bd_net [get_bd_pins processing_system7_0/FCLK_CLK0] \
  [get_bd_pins converter_1/S_AXI_ACLK] [get_bd_pins axi_interconnect_0/ACLK] [get_bd_pins axi_interconnect_0/S00_ACLK] \
  [get_bd_pins axi_interconnect_0/M00_ACLK] [get_bd_pins axi_interconnect_0/M01_ACLK] \
  [get_bd_pins axi_interconnect_0/M02_ACLK] [get_bd_pins axi_interconnect_0/M03_ACLK] \
  [get_bd_pins axi_interconnect_0/M04_ACLK] [get_bd_pins axi_interconnect_0/M05_ACLK] \
  [get_bd_pins axi_interconnect_0/M06_ACLK] [get_bd_pins axi_timer_0/s_axi_aclk] \
  [get_bd_pins processing_system7_0/M_AXI_GP0_ACLK] [get_bd_pins rst_ps7_0_100M/slowest_sync_clk] \
  [get_bd_pins processing_system7_0/S_AXI_HP0_ACLK] [get_bd_pins gigabit_block/S_AXI_ACLK] [get_bd_pins testled/s_axi_aclk]
connect_bd_net [get_bd_pins processing_system7_0/FCLK_RESET0_N] [get_bd_pins rst_ps7_0_100M/ext_reset_in]
connect_bd_net [get_bd_pins rst_ps7_0_100M/interconnect_aresetn] [get_bd_pins axi_interconnect_0/ARESETN]
connect_bd_net [get_bd_pins rst_ps7_0_100M/peripheral_aresetn] \
  [get_bd_pins converter_1/S_AXI_ARESETN] [get_bd_pins axi_interconnect_0/S00_ARESETN] \
  [get_bd_pins axi_interconnect_0/M00_ARESETN] [get_bd_pins axi_interconnect_0/M01_ARESETN] \
  [get_bd_pins axi_interconnect_0/M02_ARESETN] [get_bd_pins axi_interconnect_0/M03_ARESETN] \
  [get_bd_pins axi_interconnect_0/M04_ARESETN] [get_bd_pins axi_interconnect_0/M05_ARESETN] \
  [get_bd_pins axi_interconnect_0/M06_ARESETN] [get_bd_pins axi_timer_0/s_axi_aresetn] \
  [get_bd_pins gigabit_block/S_AXI_ARESETN] [get_bd_pins testled/s_axi_aresetn]
connect_bd_net [get_bd_pins irq_xlconcat_0/dout] [get_bd_pins processing_system7_0/IRQ_F2P]
connect_bd_net [get_bd_pins converter_1/Intr] [get_bd_pins irq_xlconcat_0/In1]
connect_bd_net [get_bd_pins converter_1/pwm_base_counter] [get_bd_pins gigabit_block/capture_pwm_sync_ce]
connect_bd_net [get_bd_pins xlconstant_0/dout] [get_bd_ports LVCT_OE_N]
connect_bd_net [get_bd_pins testled/gpio_io_o] [get_bd_ports TEST]

# ---- address map ----
assign_bd_address -offset 0x38000000 -range 128M -target_address_space [get_bd_addr_spaces gigabit_block/sfp_0_1/axi_dma_0/Data_MM2S] [get_bd_addr_segs processing_system7_0/S_AXI_HP0/HP0_DDR_LOWOCM]
assign_bd_address -offset 0x38000000 -range 128M -target_address_space [get_bd_addr_spaces gigabit_block/sfp_0_1/axi_dma_0/Data_S2MM] [get_bd_addr_segs processing_system7_0/S_AXI_HP0/HP0_DDR_LOWOCM]
assign_bd_address -offset 0x38000000 -range 128M -target_address_space [get_bd_addr_spaces gigabit_block/sfp_0_1/axi_dma_0/Data_SG] [get_bd_addr_segs processing_system7_0/S_AXI_HP0/HP0_DDR_LOWOCM]
assign_bd_address -offset 0x40400000 -range 64K -target_address_space [get_bd_addr_spaces processing_system7_0/Data] [get_bd_addr_segs gigabit_block/sfp_0_1/axi_dma_0/S_AXI_LITE/Reg]
assign_bd_address -offset 0x41200000 -range 64K -target_address_space [get_bd_addr_spaces processing_system7_0/Data] [get_bd_addr_segs testled/S_AXI/Reg]
assign_bd_address -offset 0x42800000 -range 64K -target_address_space [get_bd_addr_spaces processing_system7_0/Data] [get_bd_addr_segs axi_timer_0/S_AXI/Reg]
assign_bd_address -offset 0x43C00000 -range 64K -target_address_space [get_bd_addr_spaces processing_system7_0/Data] [get_bd_addr_segs converter_1/pwm/S_AXI/reg0]
assign_bd_address -offset 0x43C10000 -range 64K -target_address_space [get_bd_addr_spaces processing_system7_0/Data] [get_bd_addr_segs gigabit_block/drp_bridge_0/S_AXI/reg0]
assign_bd_address -offset 0x43C20000 -range 64K -target_address_space [get_bd_addr_spaces processing_system7_0/Data] [get_bd_addr_segs gigabit_block/gigabit_regarray/S_AXI/reg0]
assign_bd_address -offset 0x43C30000 -range 64K -target_address_space [get_bd_addr_spaces processing_system7_0/Data] [get_bd_addr_segs gigabit_block/sfp_0_1/axi_s_chain_link_switch_0/s_axi/reg0]

validate_bd_design
save_bd_design
